# EAGLE design NodeIrTranceiver.v2.cg2 (EAGLE 4.16)
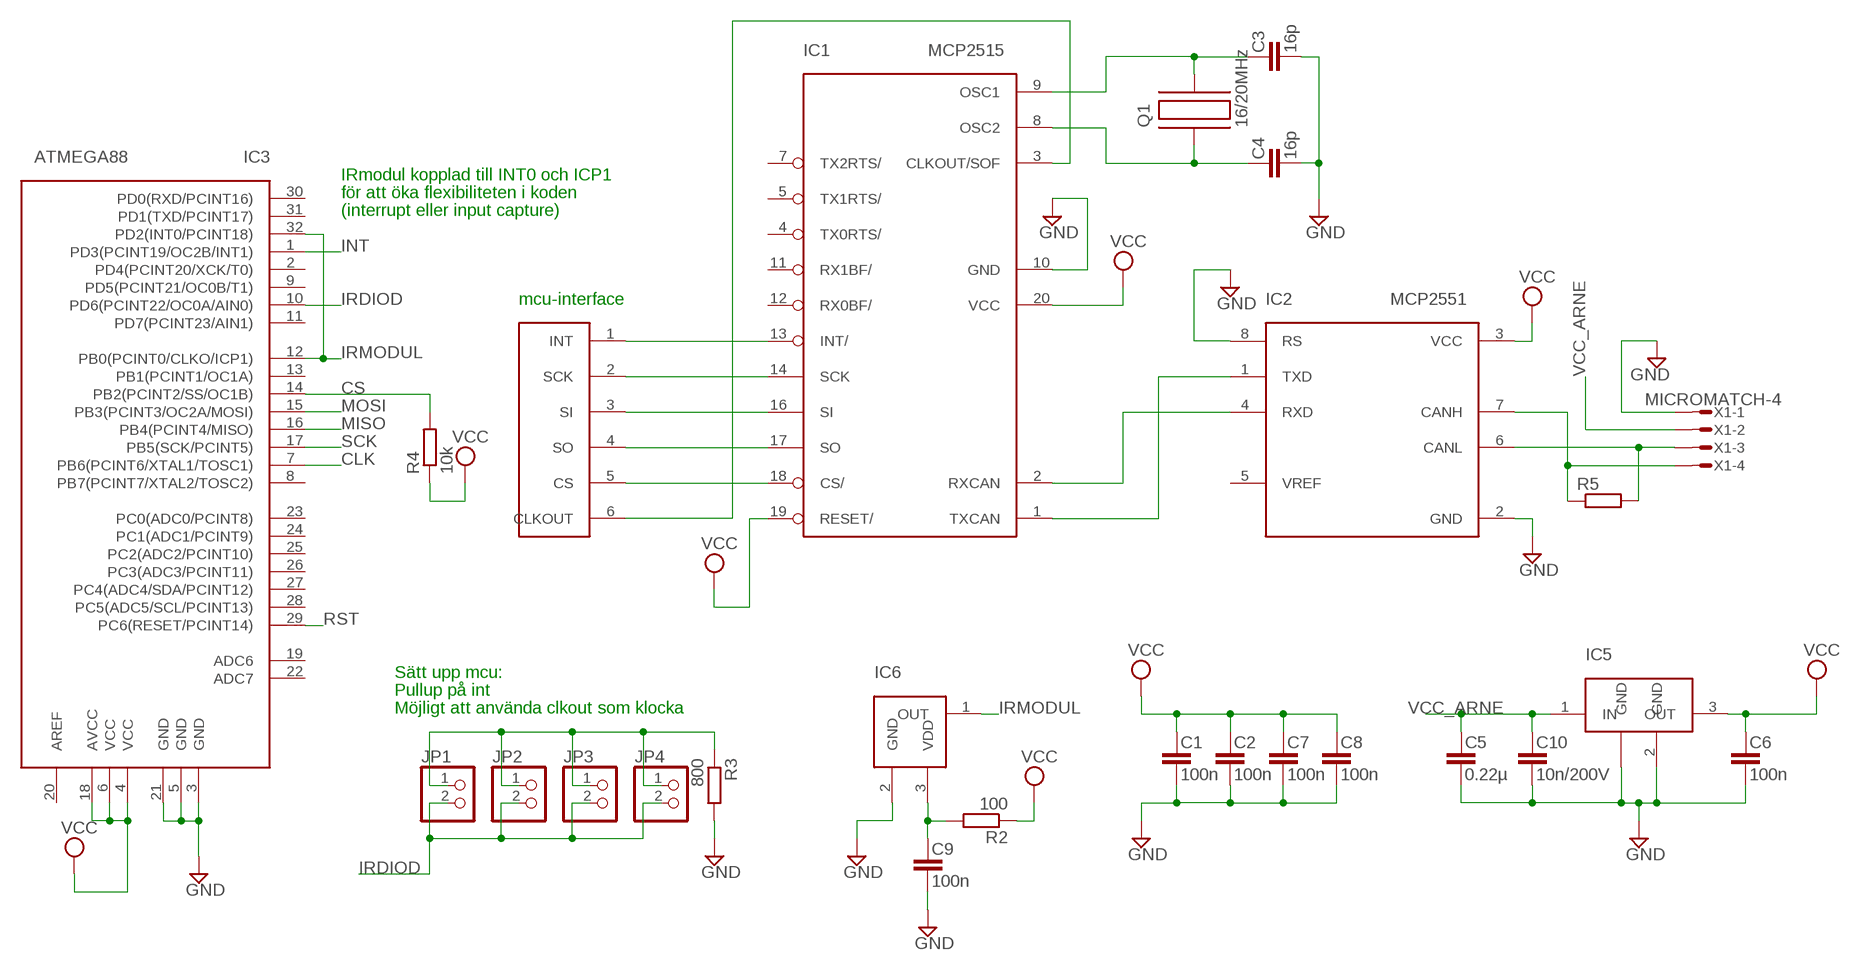
[diagram p0: schematic, sheet 1]

## Parts
C1  100n  C-EU  [C0603]
C2  100n  C-EU  [C0603]
C3  16p  C-EU  [C0603]
C4  16p  C-EU  [C0603]
C5  0.22µ  C-EU  [C0603]
C6  100n  C-EU  [C0603]
C7  100n  C-EU  [C0603]
C8  100n  C-EU  [C0603]
C9  100n  C-EU  [C0603]
C10  10n/200V  C-EU  [C0603]
IC1  MCP2515  [TSSOP]
IC2  MCP2551  [SOIC]
IC3  ATMEGA88  [TQFP32]
IC5  LM340MP-5.0  [SOT223]
IC6  ELIRM8601S  [STD]
JP1  PINHD-1X2  [1X02]
JP2  PINHD-1X2  [1X02]
JP3  PINHD-1X2  [1X02]
JP4  PINHD-1X2  [1X02]
Q1  16/20MHz  C-MAC-LFA147E  [SMD]
R2  100  R-EU_R0603  [R0603@1]
R3  800  R-EU_R0603  [R0603@1]
R4  10k  R-EUR0603  [R0603]
R5  R-EUR0603  [R0603]
U$1  CAN-INTERFACE  [VIA-LIST]
X1  MICROMATCH-4  [MICROMATCH-4]

## Nets
CANH: IC2.7(CANH) R5.1 X1.4
CANL: IC2.6(CANL) R5.2 X1.3
CLK: IC1.3(CLKOUT/SOF) IC3.7(PB6(PCINT6/XTAL1/TOSC1)) U$1.6(CLKOUT)
CS: IC1.18(CS/) IC3.14(PB2(PCINT2/SS/OC1B)) R4.2 U$1.5(CS)
GND: C1.2 C2.2 C3.2 C4.2 C5.2 C6.2 C7.2 C8.2 C9.2 C10.2 IC1.10(GND) IC2.2(GND) IC2.8(RS) IC3.3(GND) IC3.5(GND) IC3.21(GND) IC5.2(GND) IC5.4(GND) IC6.2(GND) R3.2 X1.1
INT: IC1.13(INT/) IC3.1(PD3(PCINT19/OC2B/INT1)) U$1.1(INT)
IRDIOD: IC3.10(PD6(PCINT22/OC0A/AIN0)) JP1.2 JP2.2 JP3.2 JP4.2
IRMODUL: IC3.12(PB0(PCINT0/CLKO/ICP1)) IC3.32(PD2(INT0/PCINT18)) IC6.1(OUT)
MISO: IC1.17(SO) IC3.16(PB4(PCINT4/MISO)) U$1.4(SO)
MOSI: IC1.16(SI) IC3.15(PB3(PCINT3/OC2A/MOSI)) U$1.3(SI)
N$1: IC1.2(RXCAN) IC2.4(RXD)
N$2: IC1.1(TXCAN) IC2.1(TXD)
N$3: JP1.1 JP2.1 JP3.1 JP4.1 R3.1
N$12: C3.1 IC1.9(OSC1) Q1.P$2
N$13: C4.1 IC1.8(OSC2) Q1.P$1
RST: IC3.29(PC6(RESET/PCINT14))
SCK: IC1.14(SCK) IC3.17(PB5(SCK/PCINT5)) U$1.2(SCK)
VCC: C1.1 C2.1 C6.1 C7.1 C8.1 IC1.19(RESET/) IC1.20(VCC) IC2.3(VCC) IC3.4(VCC) IC3.6(VCC) IC3.18(AVCC) IC5.3(OUT) R2.1 R4.1
VCC_ARNE: C5.1 C10.1 IC5.1(IN) X1.2
VDD: C9.1 IC6.3(VDD) R2.2
Unconnected: IC1.4(TX0RTS/) IC1.5(TX1RTS/) IC1.7(TX2RTS/) IC1.11(RX1BF/) IC1.12(RX0BF/) IC2.5(VREF) IC3.2(PD4(PCINT20/XCK/T0)) IC3.8(PB7(PCINT7/XTAL2/TOSC2)) IC3.9(PD5(PCINT21/OC0B/T1)) IC3.11(PD7(PCINT23/AIN1)) IC3.13(PB1(PCINT1/OC1A)) IC3.19(ADC6) IC3.20(AREF) IC3.22(ADC7) IC3.23(PC0(ADC0/PCINT8)) IC3.24(PC1(ADC1/PCINT9)) IC3.25(PC2(ADC2/PCINT10)) IC3.26(PC3(ADC3/PCINT11)) IC3.27(PC4(ADC4/SDA/PCINT12)) IC3.28(PC5(ADC5/SCL/PCINT13)) IC3.30(PD0(RXD/PCINT16)) IC3.31(PD1(TXD/PCINT17))

## Notes on the sheet
- IRmodul kopplad till INT0 och ICP1
- för att öka flexibiliteten i koden
- (interrupt eller input capture)
- mcu-interface
- Sätt upp mcu:
- Pullup på int
- Möjligt att använda clkout som klocka

## Library data of the parts
C1-C10 = rcl:C-EU
IC1 = mcp2515:MCP2515
IC2 = mcp2551:MCP2551
IC3 = atmega88:ATMEGA88
IC5 = lm340mp:LM340MP-5.0
IC6 = elirm8601s:ELIRM8601S
JP1-JP4 = pinhead-mm:PINHD-1X2: PIN HEADER
Q1 = hc49-4h-smx:C-MAC-LFA147E
R2 R3 = rcl:R-EU_: RESISTOR, European symbol
R4 R5 = rcl:R-EU
U$1 = can-interface:CAN-INTERFACE
X1 = con-amp-micromatch:MICROMATCH-4: MicroMaTch 4 7-215464-4 / 0-215464-4 Drawing Number C-215464 DDEController.pdf

## Board
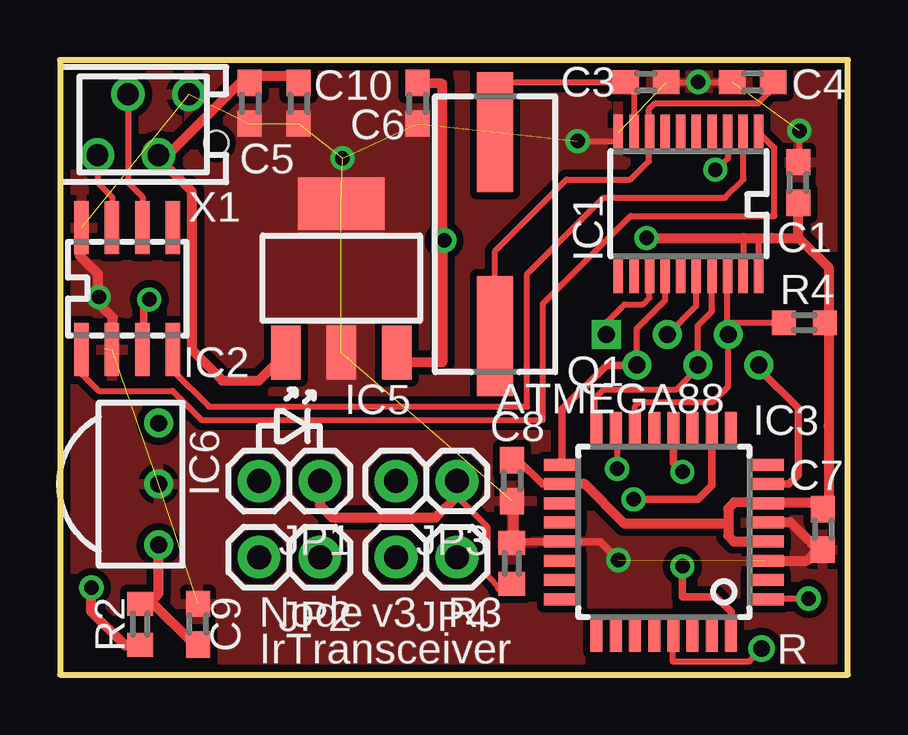
[diagram p1: board, top side]
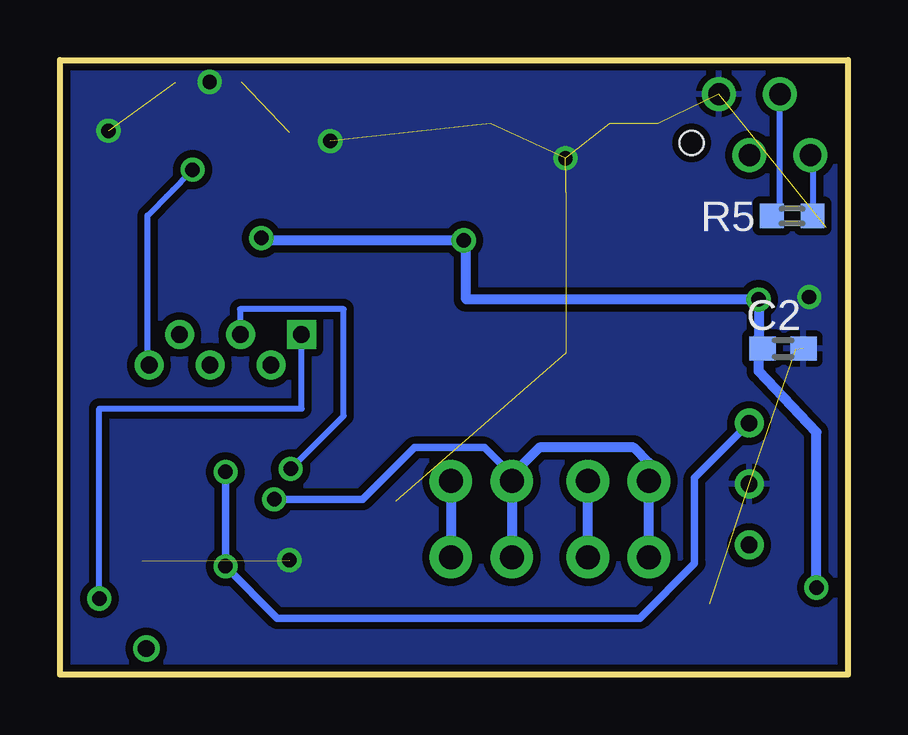
[diagram p2: board, bottom side, seen from below]

Size 32.85 x 25.63 mm. Coordinates in mm from the lower left corner, seen from the top.
Outline: 0,0 32.85,0 32.85,25.63 0,25.63 0,0
Copper layers (1*16): Top 0.035mm / dielectric 1.5mm / Bottom 0.035mm
Design rules "10mils, 0.6drill": minimum track width 10mil, minimum drill 0.6mm, track to track 10mil, track to pad 10mil, pad to pad 10mil, via to via 10mil, smd to smd 10mil, copper to edge 10mil, drill to drill 10mil, minimum pad ring 10mil, minimum via ring 8mil, stop-mask expansion 0mil, vias tented up to drill 0mil, thermal gap 10mil

### Footprints (pad centres in the part's own frame; a part is rotated, then mirrored left to right if it is on the bottom)
C0603 = smd 1.1 x 1: 1 -0.85,0; 2 0.85,0
TSSOP = smd 0.396 x 1.5: 1 -2.925,-2.975; 2 -2.275,-2.975; 3 -1.625,-2.975; 4 -0.975,-2.975; 5 -0.325,-2.975; 6 0.325,-2.975; 7 0.975,-2.975; 8 1.625,-2.975; 9 2.275,-2.975; 10 2.925,-2.975; 11 2.925,2.975; 12 2.275,2.975; 13 1.625,2.975; 14 0.975,2.975; 15 0.325,2.975; 16 -0.325,2.975; 17 -0.975,2.975; 18 -1.625,2.975; 19 -2.275,2.975; 20 -2.925,2.975
SOIC = smd 0.6 x 2.2: 1 -1.905,-2.54; 2 -0.635,-2.54; 3 0.635,-2.54; 4 1.905,-2.54; 5 1.905,2.54; 6 0.635,2.54; 7 -0.635,2.54; 8 -1.905,2.54
TQFP32 = smd 1.5 x 0.5: 1 -4.25,2.65; 2 -4.25,1.85; 3 -4.25,1.05; 4 -4.25,0.25; 5 -4.25,-0.55; 6 -4.25,-1.35; 7 -4.25,-2.15; 8 -4.25,-2.95; 17 4.25,-2.95; 18 4.25,-2.15; 19 4.25,-1.35; 20 4.25,-0.55; 21 4.25,0.25; 22 4.25,1.05; 23 4.25,1.85; 24 4.25,2.65 | smd 0.5 x 1.5: 9 -2.8,-4.4; 10 -2,-4.4; 11 -1.2,-4.4; 12 -0.4,-4.4; 13 0.4,-4.4; 14 1.2,-4.4; 15 2,-4.4; 16 2.8,-4.4; 25 2.8,4.1; 26 2,4.1; 27 1.2,4.1; 28 0.4,4.1; 29 -0.4,4.1; 30 -1.2,4.1; 31 -2,4.1; 32 -2.8,4.1
SOT223 = smd 1.219 x 2.235: 1 -2.311,-3.099; 2 0,-3.099; 3 2.311,-3.099 | smd 3.6 x 2.2: 4 0,3.099
STD = drill 0.7 round: 1 2.54,-0.9; 2 0,-0.9; 3 -2.54,-0.9
1X02 = drill 1 pad 1.778 round: 1 -1.27,0; 2 1.27,0
SMD = smd 5 x 1.5: P$1 4.25,0; P$2 -4.25,0
R0603@1 = smd 1 x 1.1: 1 -0.85,0; 2 0.85,0
R0603 = smd 0.991 x 1.016: 1 -0.85,0; 2 0.85,0
VIA-LIST = drill 0.7 square: 1 0,2.54 | drill 0.7 round: 2 -1.27,1.27; 3 0,0; 4 -1.27,-1.27; 5 0,-2.54; 6 -1.27,-3.81
MICROMATCH-4 = drill 0.9 round: 1 1.905,1.27; 2 0.635,-1.27; 3 -0.635,1.27; 4 -1.905,-1.27 | hole 1: 3.048,-0.762

### Placement (x,y rotation side)
C1  30.78,20.52 90 top
C2  2.7,13.6 0 bottom
C3  24.43,24.72 0 top
C4  28.87,24.72 180 top
C5  7.92,23.83 270 top
C6  14.9,23.83 270 top
C7  31.8,6.06 270 top
C8  18.84,8.09 270 top
C9  5.76,2.11 90 top
C10  9.95,23.83 270 top
IC1  26.21,19.64 180 top
IC2  2.8,16.1 0 top
IC3  25.17,5.8 180 top
IC5  11.73,16.54 0 top
IC6  3.22,7.95 90 top
JP1  9.57,8.08 180 top
JP2  9.57,4.9 180 top
JP3  15.28,8.08 180 top
JP4  15.28,4.9 180 top
Q1  18.14,18.37 270 top
R2  3.34,2.11 90 top
R3  18.84,4.65 90 top
R4  31.03,14.68 180 top
R5  2.33,19.13 180 bottom
U$1  25.33,14.18 90 top
X1  3.47,22.94 0 top

### Tracks (layer width: path | path; a pad name or v marks a point on that pad's centre or on a via)
CANH
  Top 0.254: IC2.7 2.17,19.92 1.57,20.52 X1.4
  Bottom 0.254: X1.4 1.44,21.67 1.44,19.17 R5.1
CANL
  Top 0.254: IC2.6 3.44,19.92 2.84,20.52 X1.3
  Bottom 0.254: R5.2 2.84,19.47 X1.3
CLK  (via drill 0.6)
  Top 0.254: IC1.3 27.86,22.59 27.86,21.54 27.35,21.03 v27.32,21.06
  Top 0.305: IC3.7 30.39,7.95 30.78,8.33 30.78,11.13 29.12,12.78 29.14,12.79 U$1.6
  Bottom 0.254: v27.32,21.06 29.2,19.15 29.2,12.93 U$1.6
CS
  Top 0.254: 27.83,14.68 27.83,14.2 27.87,14.16 U$1.5 27.87,14.06 27.86,14.05 27.86,12.02 27.22,11.38 24.17,11.38 23.97,11.18 IC3.14 | 27.83,14.68 IC1.18 | 27.83,14.68 R4.2
GND  (via drill 0.6, 0.61)  (15 unrouted)
  Top 0.254: v21.58,22.25 23.28,22.25 IC1.10 | v30.83,22.68 30.83,21.69 C1.2 | 1.59,15.5 v1.62,15.75 | IC3.21 21.28,5.54 | C3.2 26.46,24.72 26.58,24.59 | 26.58,24.59 26.61,24.56 v26.61,24.72 | C4.2 26.71,24.72 26.58,24.59
  Top 0.305: IC2.2 2.2,13.9 | R3.2 18.96,5.54 | 18.96,5.54 18.96,7.24 C8.2 18.84,5.67 18.96,5.54 | IC3.21 20.91,5.54 18.96,5.54 | 18.96,5.54 22.52,5.54 v23.28,4.78
  Top 0.406: 2.2,13.9 2.2,14.89 1.59,15.5 1.59,16.71 0.83,17.48 IC2.8 | C7.2 31.72,5.21 31.67,5.16 31.6,5.22 | IC3.5 30.47,6.35 31.6,5.22 | 31.6,5.22 31.67,5.28 | IC3.3 31.14,4.75 31.6,5.22
  Bottom 0.305: v26.61,24.72 26.81,24.49 | v23.28,4.78 23.28,4.65
  other vias: 11.78,21.53
  pour Bottom (isolate 0.305): 0.12,25.53 32.83,25.53 32.83,0.1 24.38,0.1 0.12,0.1
  pour Top (isolate 0.305, no thermals): 6.19,25.04 15.77,25.04 15.77,11.72 6.19,11.72
  pour Top (isolate 0.305): 0.17,25.48 32.68,25.48 32.68,0.08 0.17,0.08
INT  (via drill 0.6)
  Top 0.254: 29.94,3.18 v31.21,3.18 | IC1.13 24.58,15.73 24.3,15.44 23.54,15.44 22.77,14.68 22.77,14.17 22.79,14.16 U$1.1
  Top 0.305: IC3.1 29.94,3.18
  Bottom 0.254: v31.21,3.18 31.21,11.1 22.77,11.1 22.77,14.05 22.79,14.06 U$1.1
IRDIOD  (via drill 0.6)
  Top 0.305: IC3.10 27.17,7.91 26.58,7.32 v23.92,7.32
  Bottom 0.305: v23.92,7.32 20.23,7.32 18.08,9.48 15.15,9.48 14.01,8.33
  Bottom 0.406: JP2.2 JP1.2 8.3,8.84 8.93,9.48 12.87,9.48 14.01,8.33 JP3.2 JP4.2
IRMODUL  (via drill 0.6)
  Top 0.305: IC3.32 27.97,1.47 27.98,1.47 27.98,2.62 27.35,3.25 25.95,3.25 v25.95,4.52 | IC3.12 25.57,10.12 25.57,10.11 25.57,8.84 v25.95,8.46
  Bottom 0.305: v25.95,8.46 v25.95,4.52 23.79,2.36 19.47,2.36 8.68,2.36 6.39,4.65 6.39,8.21 4.11,10.49 IC6.1
MISO
  Top 0.254: IC3.16 22.29,10.52 22.29,11.53 22.65,11.89 25.7,11.89 26.6,12.79 U$1.4 26.6,13.02 26.58,13.03 26.58,14.55 27.18,15.15 IC1.17
MOSI  (via drill 0.6)
  Top 0.254: v23.23,8.59 23.23,9.8 IC3.15 | U$1.3 25.33,14.16 25.31,14.17 26.53,15.39 IC1.16
  Bottom 0.254: v23.23,8.59 21.02,10.8 21.02,15.24 25.34,15.24 25.34,14.73 U$1.3
N$1
  Top 0.254: IC2.4 4.74,12.65 6.21,11.18 19.47,11.18 19.47,16.71 22.65,19.89 27.73,19.89 28.49,20.65 IC1.2
N$2
  Top 0.254: IC2.1 0.93,12.52 1.62,11.84 4.69,11.84 5.91,10.62 20.13,10.62 20.13,15.47 23.79,19.13 29.79,19.13 29.79,21.96 IC1.1
N$3
  Top 0.254: 18.33,3.63 17.82,4.14 17.82,6.17 16.55,7.44
  Top 0.406: JP1.1 10.84,7.06 11.34,6.55 15.66,6.55 16.55,7.44 JP3.1 | R3.1 18.8,3.63 18.33,3.63
  Bottom 0.406: JP2.1 JP1.1 | JP3.1 JP4.1
N$12
  Top 0.254: Q1.P$2 18.14,24.28 18.58,24.72 23.54,24.72 23.58,24.68 | 23.58,24.68 23.66,24.59 23.79,24.59 23.92,24.46 23.92,22.68 23.93,22.67 IC1.9 | 23.58,24.68 C3.1
N$13
  Top 0.254: C4.1 29.76,24.72 29.89,24.59 29.12,23.83 24.81,23.83 24.55,23.57 24.55,22.49 24.55,21.41 23.79,20.65 21.12,20.65 18.14,17.67 Q1.P$1
  Top 0.305: 24.55,22.49 IC1.8
RST  (via drill 0.7)
  Top 0.254: IC3.29 25.57,1.61 25.54,1.58 25.54,0.56 28.74,0.56 29.1,0.92 29.1,0.94 v29.25,1.09
SCK
  Top 0.254: IC1.14 25.23,15.61 24.04,14.43 24.04,12.9 24.06,12.89 U$1.2
  Top 0.305: IC3.17 20.92,11.05 22.77,12.9 24.04,12.9 U$1.2
VCC  (via drill 0.6)
  Top 0.254: 29.12,16.69 29.15,16.77 29.13,16.78 IC1.20 29.12,16.79 29.12,18.21 29.68,18.21 | 29.81,7.16 IC3.6 | IC1.19 28.48,16.72 28.49,16.71 28.49,18.21 | R4.1 31.92,14.68 32.05,14.55
  Top 0.305: C8.1 18.86,8.97 19.09,8.97 20.11,7.95 IC3.18 | IC2.3 3.49,13.56 3.49,15.34 3.73,15.57 v3.73,15.65
  Top 0.406: C6.1 15.95,24.64 15.95,17.73 | 15.95,17.73 15.95,13.02 14.08,13.02 14.08,13.71 IC5.3 | v16.02,18.11 15.95,17.73 | v24.45,18.21 28.49,18.21 29.68,18.21 | 29.68,18.21 | 29.68,18.21 30.78,18.21 30.78,18.24 | 30.78,18.24 C1.1 | 32.05,10.36 32.05,10.4 | 32.05,10.36 32.05,14.55 32.05,16.97 30.78,18.24 | 29.81,7.16 31.56,7.16 C7.1 31.9,6.91 32.05,7.06 32.05,10.36 | IC3.4 28.09,5.55 27.86,5.79 27.86,6.3 | 27.86,6.3 27.86,6.94 28.11,7.19 29.39,7.19 IC3.6 | 27.86,6.3 23.54,6.3 21.89,7.95 IC3.18 | R2.1 3.38,1.26 3.09,1.22 2.71,1.22 1.31,2.62 v1.31,3.63
  Bottom 0.254: C2.1 3.73,13.6 3.73,15.57
  Bottom 0.305: v3.73,15.65 3.73,15.7 | 3.73,13.67 3.73,15.57
  Bottom 0.406: 3.73,14.1 3.73,15.57 v3.73,15.65 15.92,15.65 15.92,18.11 v16.02,18.11 24.3,18.11 24.4,18.21 v24.45,18.21 | v1.31,3.63 1.31,10.11 3.73,12.65 3.73,13.67 | C2.1 3.54,13.6
VCC_ARNE
  Top 0.305: C5.1 7.84,24.77 | IC5.1 9.44,13.44 9.44,13.54
  Top 0.406: C10.1 9.95,24.97 7.92,24.97 C5.1 7.57,24.68 7.54,24.72 4.49,21.67 | 4.49,21.67 X1.2 | 4.49,21.67 4.49,21.16 5.5,20.14 5.5,13.54 6.77,12.27 8.3,12.27 9.44,13.41 IC5.1
VDD
  Top 0.406: IC6.3 4.11,5.15 4.11,3.38 3.73,3 3.64,3 R2.2 3.89,2.96 5.5,1.35 6.05,1.35 C9.1

### Text on the board
tPlace: Node | v3 | IrTransceiver | R